# EAGLE schematic Board (EAGLE 6.5.0)
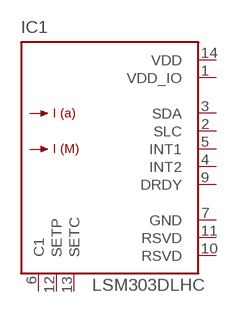
[diagram p0: schematic, sheet 1]

## Parts
IC1  LSM303DLHC  [LGA-14]
Unconnected: IC1.2(SLC) IC1.3(SDA) IC1.4(INT2) IC1.5(INT1) IC1.6(C1) IC1.9(DRDY) IC1.10(RSVD) IC1.11(RSVD) IC1.12(SETP) IC1.13(SETC)

## Power pins joined to a net without a drawn wire
GND: IC1.7(GND)
VDD: IC1.14(VDD)
VDD_IO: IC1.1(VDD_IO)

## Library data of the parts
IC1 = st-microelectronics:LSM303DLHC: Ultra compact high performance e-compass, 3D accelerometer and 3D magnetometer module Source: DM00027543-118326.pdf